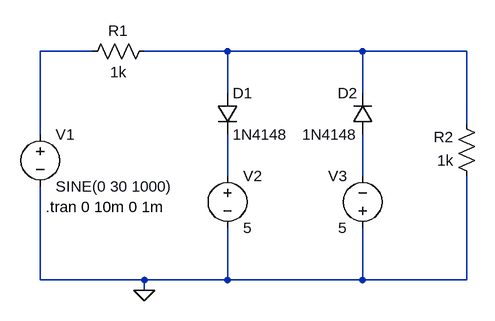
[diagram p0: schematic Combination Biased Circuit.asc]
Combination Biased Circuit.asc, the LTspice schematic file:
Version 4
SHEET 1 880 680
WIRE 144 144 64 144
WIRE 352 144 224 144
WIRE 560 144 352 144
WIRE 720 144 560 144
WIRE 352 208 352 144
WIRE 560 208 560 144
WIRE 720 256 720 144
WIRE 64 272 64 144
WIRE 352 336 352 272
WIRE 560 336 560 272
WIRE 64 496 64 352
WIRE 224 496 64 496
WIRE 352 496 352 416
WIRE 352 496 224 496
WIRE 560 496 560 416
WIRE 560 496 352 496
WIRE 720 496 720 336
WIRE 720 496 560 496
WIRE 224 512 224 496
FLAG 224 512 0
SYMBOL res 240 128 R90
WINDOW 0 0 56 VBottom 2
WINDOW 3 32 56 VTop 2
SYMATTR InstName R1
SYMATTR Value 1k
SYMBOL res 736 352 R180
WINDOW 0 36 76 Left 2
WINDOW 3 36 40 Left 2
SYMATTR InstName R2
SYMATTR Value 1k
SYMBOL voltage 64 256 R0
SYMATTR InstName V1
SYMATTR Value SINE(0 30 1000)
SYMBOL voltage 352 320 R0
SYMATTR InstName V2
SYMATTR Value 5
SYMBOL voltage 560 432 R180
WINDOW 0 24 96 Left 2
WINDOW 3 24 16 Left 2
SYMATTR InstName V3
SYMATTR Value 5
SYMBOL diode 336 208 R0
SYMATTR InstName D1
SYMATTR Value 1N4148
SYMBOL diode 576 272 R180
WINDOW 0 24 64 Left 2
WINDOW 3 24 0 Left 2
SYMATTR InstName D2
SYMATTR Value 1N4148
TEXT 72 384 Left 2 !.tran 0 10m 0 1m

The netlist it stands for:
* Combination Biased Circuit.asc
R1 N002 N001 1k
R2 0 N002 1k
V1 N001 0 SINE(0 30 1000)
V2 N003 0 5
V3 0 N004 5
D1 N002 N003 1N4148
D2 N004 N002 1N4148
.model D D
.lib standard.dio
.tran 0 10m 0 1m
.backanno
.end